# EAGLE design vf_zes (EAGLE 6.5.0)
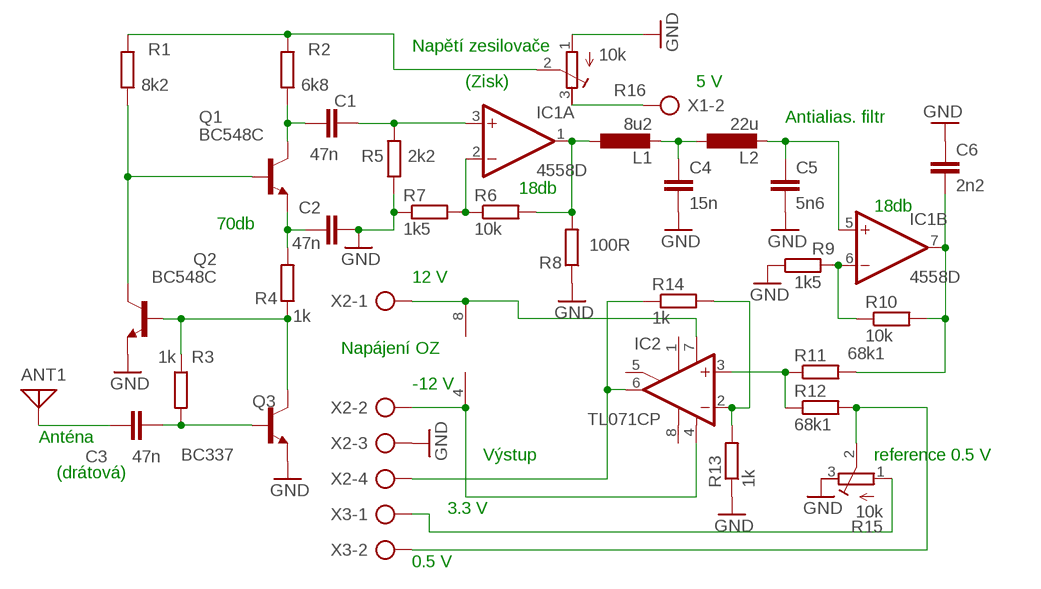
[diagram p0: schematic, sheet 1]

## Parts
ANT1  ANTENNA  [PAD-01]
C1  47n  C-EU025-025X050  [C025-025X050]
C2  47n  C-EU025-025X050  [C025-025X050]
C3  47n  C-EU025-025X050  [C025-025X050]
C4  15n  C-EU050-025X075  [C050-025X075]
C5  5n6  C-EU050-025X075  [C050-025X075]
C6  2n2  C-EU050-030X075  [C050-030X075]
IC1  4558D  LF442N  [DIL08]
IC2  TL071CP  TL071P  [DIL08]
L1  8u2  L-EU0207/12  [0207/12]
L2  22u  L-EU0207/12  [0207/12]
Q1  BC548C  BC548A  [TO92-EBC]
Q2  BC548C  BC548A  [TO92-EBC]
Q3  BC337  BC548A  [TO92-EBC]
R1  8k2  R-EU_0207/10  [0207/10]
R2  6k8  R-EU_0207/10  [0207/10]
R3  1k  R-EU_0207/10  [0207/10]
R4  1k  R-EU_0207/10  [0207/10]
R5  2k2  R-EU_0207/10  [0207/10]
R6  10k  R-EU_0207/10  [0207/10]
R7  1k5  R-EU_0207/10  [0207/10]
R8  100R  R-EU_0207/10  [0207/10]
R9  1k5  R-EU_0207/10  [0207/10]
R10  10k  R-EU_0207/10  [0207/10]
R11  68k1  R-EU_0309/12  [0309/12]
R12  68k1  R-EU_0309/12  [0309/12]
R13  1k  R-EU_0309/12  [0309/12]
R14  1k  R-EU_0309/12  [0309/12]
R15  10k  R-TRIMM64W  [RTRIM64W]
R16  10k  R-TRIMM64X  [RTRIM64X]
X1  AK300/2  [AK300/2]
X2  AK500/4-H  [AK500/4-H]
X3  AK500/2-H  [AK500/2-H]

## Nets
GND: C2.2 C4.2 C5.2 C6.1 Q2.E Q3.E R5.1 R7.1 R8.1 R9.1 R13.1 R15.3(A) R16.1(A) X2.3
N$1: Q1.B Q2.C R1.1
N$2: C1.1 Q1.C R2.1
N$3: C2.1 Q1.E R4.2
N$4: R1.2 R2.2 R16.2(S)
N$5: Q2.B Q3.C R3.1 R4.1
N$6: C3.2 Q3.B R3.2
N$7: C1.2 IC1.3(A:+IN) R5.2
N$8: ANT1.1 C3.1
N$9: IC1.2(A:-IN) R6.1 R7.2
N$10: IC1.1(A:OUT) L1.1 R6.2 R8.2
N$11: C4.1 L1.2 L2.1
N$12: C5.1 IC1.5(B:+IN) L2.2
N$13: IC1.6(B:-IN) R9.2 R10.1
N$14: C6.2 IC1.7(B:OUT) R10.2 R11.2
N$15: IC2.3(+IN) R11.1 R12.1
N$16: R12.2 R15.2(S) X3.2
N$17: IC2.2(-IN) R13.2 R14.2
N$18: IC2.6(OUT) R14.1 X2.4
N$20: R15.1(E) X3.1
N$21: IC1.8(P:V+) IC2.7(V+) X2.1
N$22: IC1.4(P:V-) IC2.4(V-) X2.2
N$23: R16.3(E) X1.2
Unconnected: IC2.1(ON1) IC2.5(ON2) IC2.8(OPT) X1.1

## Notes on the sheet
- Napětí zesilovače
- (Zisk) | 5 V
- Antialias. filtr
- 18db
- 18db
- 70db
- 12 V
- Napájení OZ
- -12 V
- Anténa
- Výstup | reference 0.5 V
- (drátová)
- 3.3 V
- 0.5 V

## Library data of the parts
ANT1 = discrete:ANTENNA: Antenna
C1-C3 = resistor:C-EU: CAPACITOR, European symbol
C4-C6 = rcl:C-EU: CAPACITOR, European symbol
IC1 = linear:LF442: OP AMP
IC2 = linear:TL071: OP AMP
L1 L2 = rcl:L-EU: INDUCTOR, European symbol
Q1-Q3 = transistor-npn:BC548*: NPN Transistor
R1-R4 = resistor:R-EU_: RESISTOR, European symbol
R5-R14 = rcl:R-EU_: RESISTOR, European symbol
R15 = resistor:R-TRIMM: Trimm resistor
R16 = rcl:R-TRIMM: Trimm resistor
X1 = con-ptr500:AK300/2: CONNECTOR; OC_FARNELL: unknown; OC_NEWARK: unknown
X2 = con-ptr500:AK500/4-H: CONNECTOR Aug. 2004 / PTR Meßtechnik: Die Bezeichnung der Serie AK505 wurde geändert. Es handelt sich hierbei um AK500 in horizontaler Ausführung.; OC_FARNELL: unknown; OC_NEWARK: unknown
X3 = con-ptr500:AK500/2-H: CONNECTOR Aug. 2004 / PTR Meßtechnik: Die Bezeichnung der Serie AK505 wurde geändert. Es handelt sich hierbei um AK500 in horizontaler Ausführung.; OC_FARNELL: unknown; OC_NEWARK: unknown

## Board
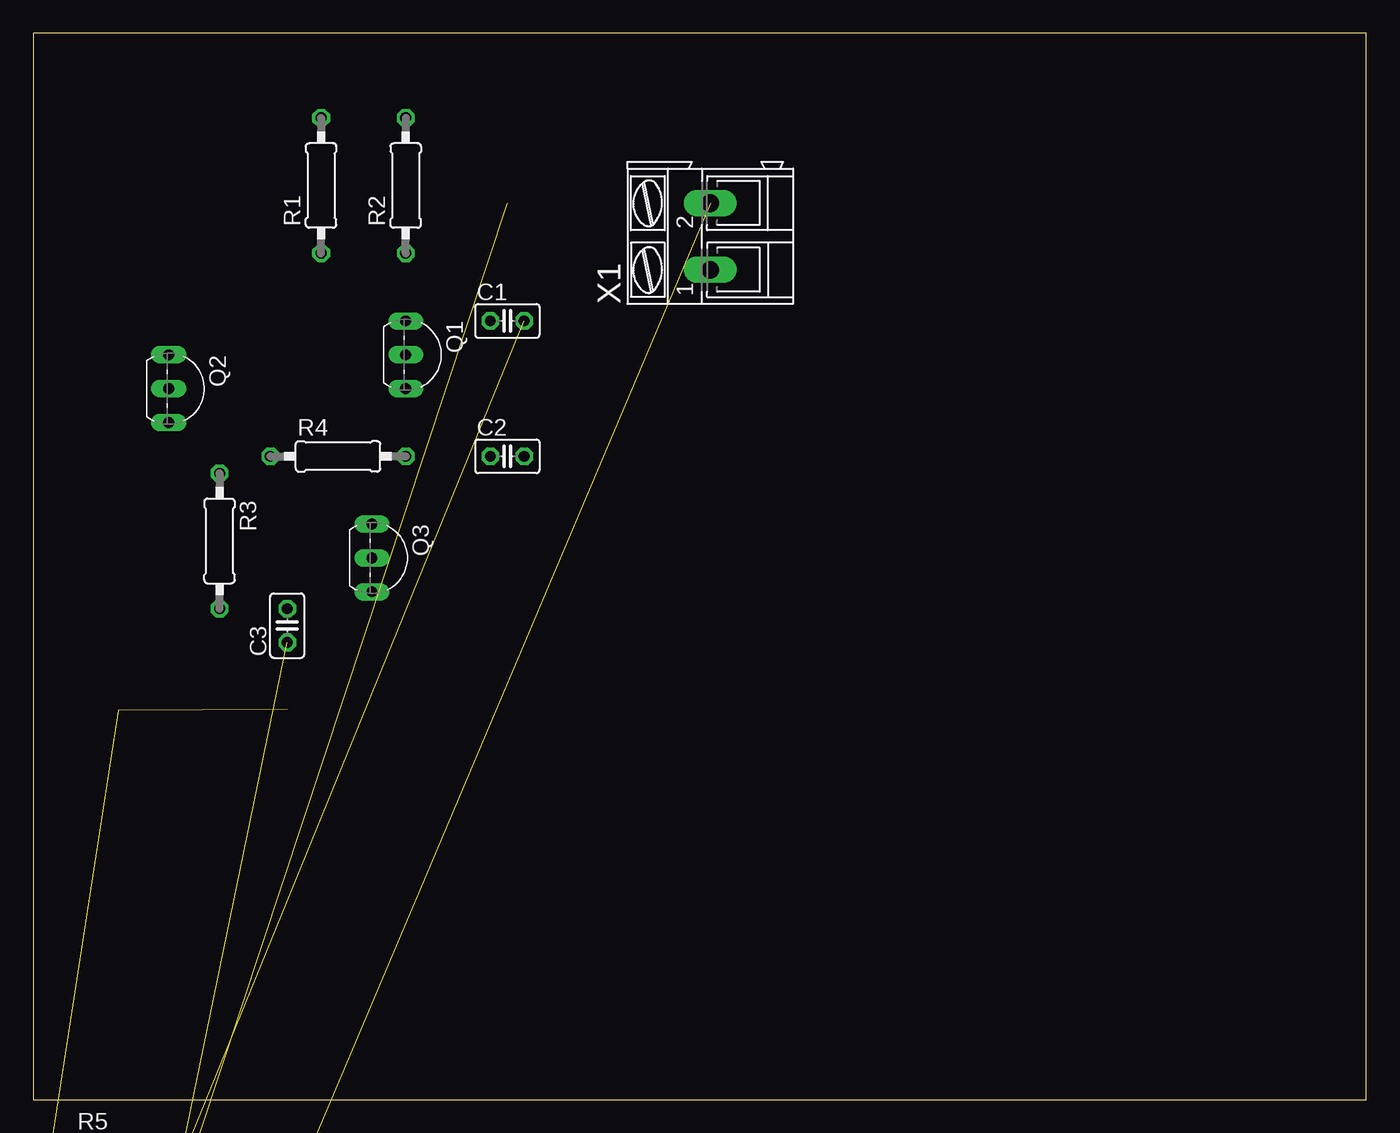
[diagram p1: board, top side]
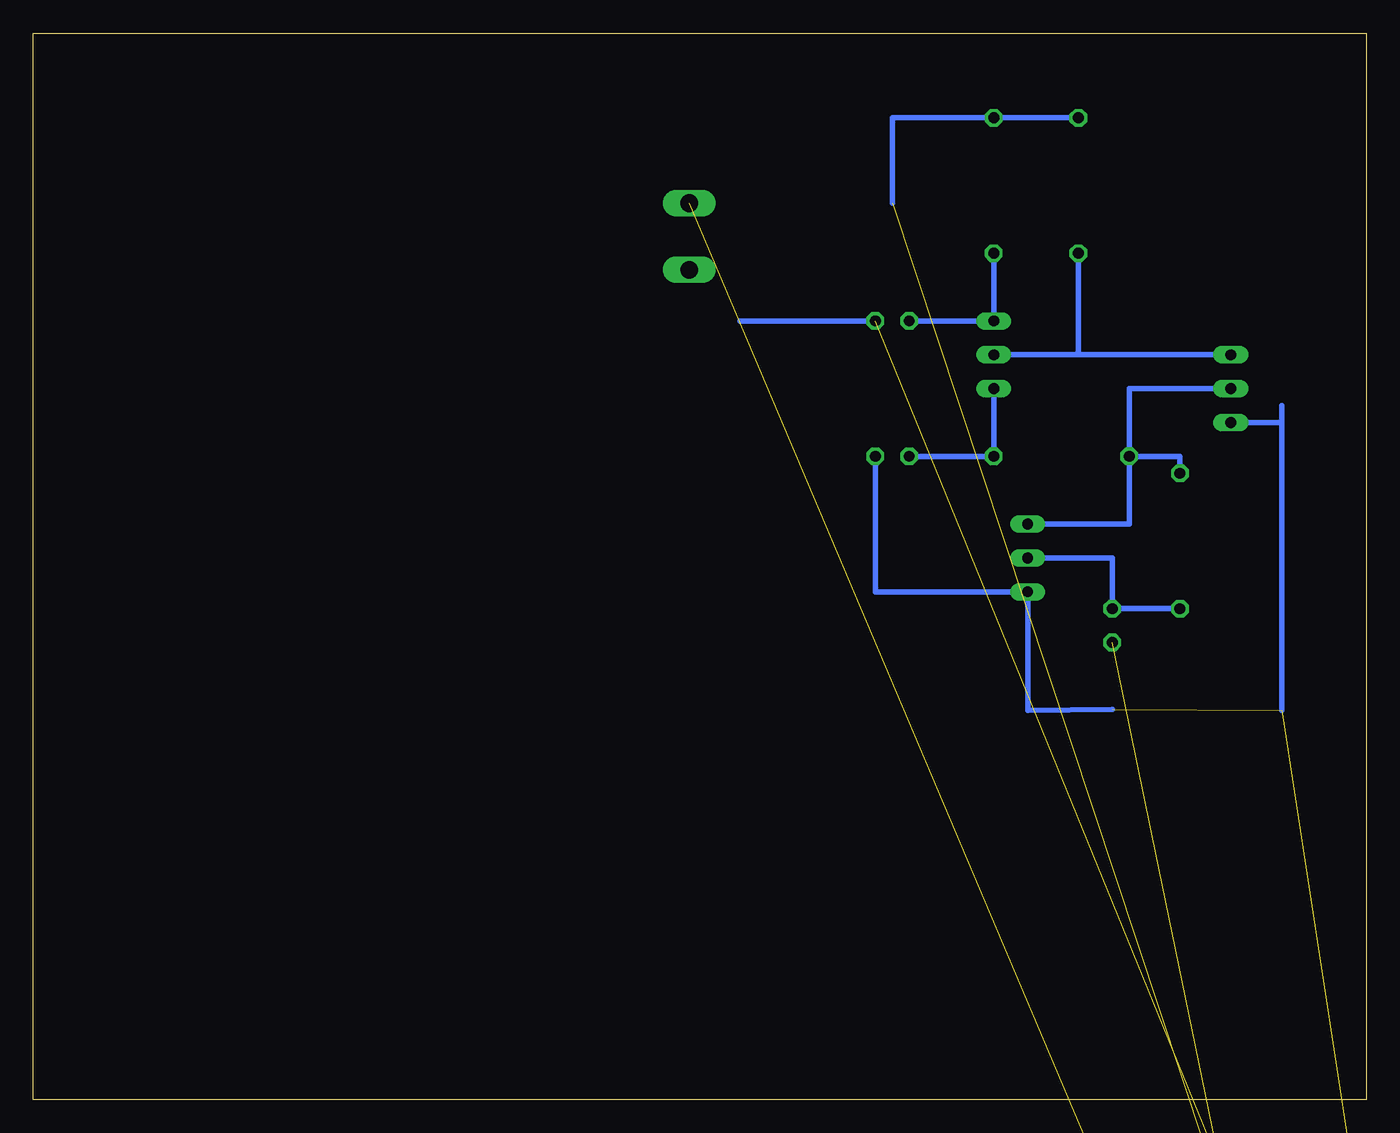
[diagram p2: board, bottom side, seen from below]

Size 100 x 80 mm. Coordinates in mm from the lower left corner, seen from the top.
Outline: 0,0 100,0 100,80 0,80 0,0
Copper layers (1*16): Top 0.035mm / dielectric 1.5mm / Bottom 0.035mm
Design rules "default": minimum track width 10mil, minimum drill 24mil, track to track 8mil, track to pad 8mil, pad to pad 8mil, via to via 8mil, smd to smd 8mil, copper to edge 40mil, drill to drill 8mil, minimum pad ring 10mil, minimum via ring 8mil, stop-mask expansion 4mil, vias tented up to drill 0mil, thermal gap 10mil

### Footprints (pad centres in the part's own frame; a part is rotated, then mirrored left to right if it is on the bottom)
PAD-01 = drill 1.321 pad 2.54 octagon: 1 0,0
C025-025X050 = drill 0.813 octagon: 1 -1.27,0; 2 1.27,0
C050-025X075 = drill 0.813 octagon: 1 -2.54,0; 2 2.54,0
C050-030X075 = drill 0.813 octagon: 1 -2.54,0; 2 2.54,0
DIL08 = drill 0.813 pad 1.27: 1 -3.81,-3.81; 2 -1.27,-3.81; 3 1.27,-3.81; 4 3.81,-3.81; 5 3.81,3.81; 6 1.27,3.81; 7 -1.27,3.81; 8 -3.81,3.81
0207/12 = drill 0.813 octagon: 1 -6.35,0; 2 6.35,0
TO92-EBC = drill 0.813 long: B 0,-1.27; C -2.54,-1.27; E 2.54,-1.27
0207/10 = drill 0.813 octagon: 1 -5.08,0; 2 5.08,0
0309/12 = drill 0.813 octagon: 1 -6.35,0; 2 6.35,0
RTRIM64W = drill 0.61: 1 1.27,-2.54; 2 1.27,0; 3 1.27,2.54
RTRIM64X = drill 0.61: 1 1.27,-2.54; 2 1.27,0; 3 1.27,2.54
AK300/2 = drill 1.321 long: 1 -2.515,0; 2 2.489,0
AK500/4-H = drill 1.321 long: 1 -7.518,0; 2 -2.489,0; 3 2.489,0; 4 7.518,0
AK500/2-H = drill 1.321 long: 1 -2.515,0; 2 2.515,0

### Placement (x,y rotation side)
ANT1  2.54,-45.72 0 top  (outside the outline)
C1  35.56,58.42 0 top
C2  35.56,48.26 0 top
C3  19.05,35.56 90 top
C4  5.08,-60.96 0 top  (outside the outline)
C5  5.08,-66.04 0 top  (outside the outline)
C6  -24.13,-119.38 0 top  (outside the outline)
IC1  7.62,-35.56 0 top  (outside the outline)
IC2  7.62,-72.39 0 top  (outside the outline)
L1  7.62,-50.8 0 top  (outside the outline)
L2  7.62,-55.88 0 top  (outside the outline)
Q1  29.21,55.88 270 top
Q2  11.43,53.34 270 top
Q3  26.67,40.64 270 top
R1  21.59,68.58 90 top
R2  27.94,68.58 90 top
R3  13.97,41.91 270 top
R4  22.86,48.26 0 top
R5  6.35,-3.81 0 top  (outside the outline)
R6  6.35,-8.89 0 top  (outside the outline)
R7  6.35,-13.97 0 top  (outside the outline)
R8  6.35,-19.05 0 top  (outside the outline)
R9  6.35,-24.13 0 top  (outside the outline)
R10  6.35,-29.21 0 top  (outside the outline)
R11  7.62,-81.28 0 top  (outside the outline)
R12  7.62,-87.63 0 top  (outside the outline)
R13  7.62,-93.98 0 top  (outside the outline)
R14  7.62,-100.33 0 top  (outside the outline)
R15  -5.08,-95.25 0 top  (outside the outline)
R16  -24.13,-109.22 0 top  (outside the outline)
X1  50.8,64.77 90 top
X2  2.54,-107.95 0 top  (outside the outline)
X3  -15.24,-104.14 0 top  (outside the outline)

### Tracks (layer width: path | path; a pad name or v marks a point on that pad's centre or on a via)
GND  (12 unrouted)
  Bottom 0.406: 19.05,29.26 25.4,29.21 Q3.E 36.83,38.1 36.83,46.99 36.83,47.02 C2.2 | 6.35,29.21 6.35,50.8 | 6.35,52.07 6.35,50.8 | 6.35,50.8 Q2.E
N$1
  Bottom 0.406: Q1.B 21.59,55.88 | 21.59,55.88 R1.1 | Q2.C 21.59,55.88
N$2
  Bottom 0.406: R2.1 Q1.C C1.1
N$3
  Bottom 0.406: Q1.E R4.2 C2.1
N$4  (1 unrouted)
  Bottom 0.406: R1.2 R2.2 35.56,73.66 35.56,67.26
N$5
  Bottom 0.406: Q3.C 17.78,43.18 R4.1 | 17.78,49.53 R4.1 | R4.1 17.78,53.34 Q2.B | R3.1 13.97,48.26 R4.1
N$6
  Bottom 0.406: Q3.B 19.05,40.64 C3.2 R3.2
N$7  (2 unrouted)
  Bottom 0.406: 46.99,58.42 C1.2
N$8  (1 unrouted)
N$9  (2 unrouted)
N$10  (3 unrouted)
N$11  (2 unrouted)
N$12  (2 unrouted)
N$13  (2 unrouted)
N$14  (3 unrouted)
N$15  (2 unrouted)
N$16  (2 unrouted)
N$17  (2 unrouted)
N$18  (2 unrouted)
N$20  (1 unrouted)
N$21  (2 unrouted)
N$22  (2 unrouted)
N$23  (1 unrouted)